# Altium project nrf52840_qiaa_config6.PrjPCB
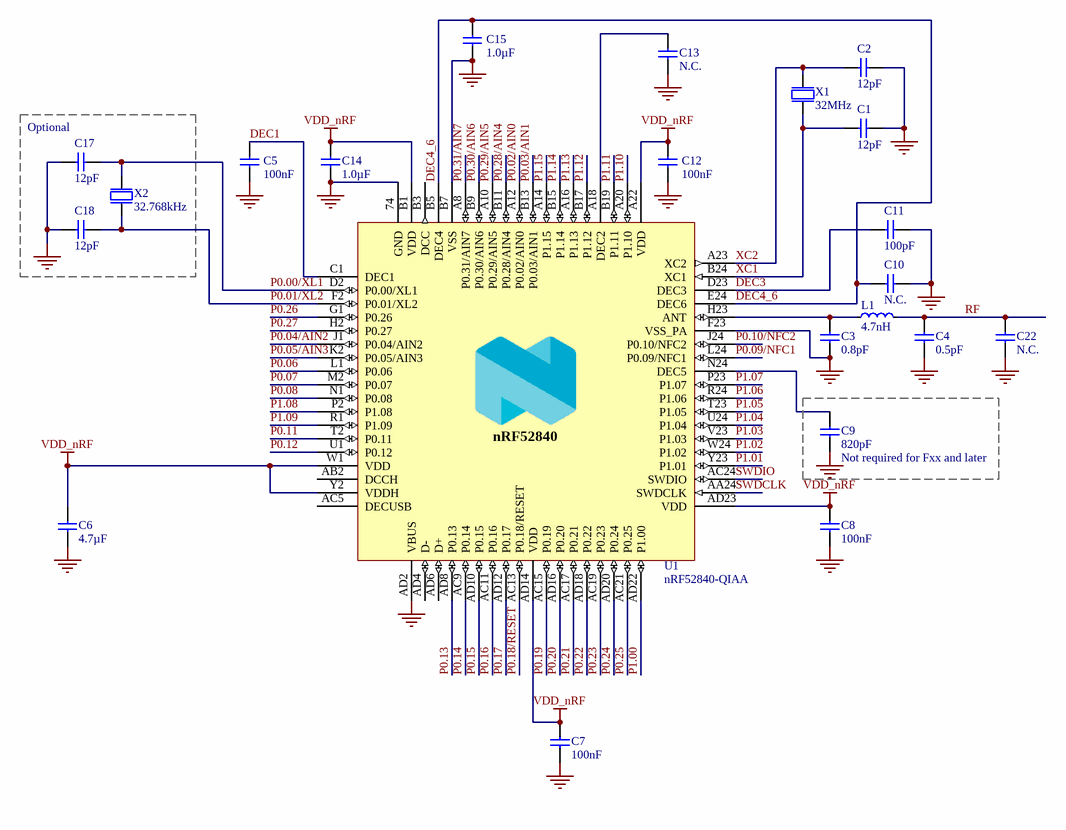
[diagram p0: nrf52840_qiaa_config6.SchDoc]
1 sheet, 22 parts. Net scope: global (net labels, ports and power ports of the same name join across sheets).
Board file: nrf52840_qiaa_config6.PcbDoc

## Sheet nrf52840_qiaa_config6.SchDoc
size A4; Revision: 1.3; SheetNumber: 1; SheetTotal: 1; DrawnBy: RUBR; DocumentSize: A4; RefLayoutTitle: Reference Layout Config. 6: VDD supply, LDO only, No USB; Device: nRF52840-QIAA

### Parts
C1  12pF  [CAPC1005X04L]
C2  12pF  [CAPC1005X04L]
C3  0.8pF  [CAPC1005X04L]
C4  0.5pF  [CAPC1005X04L]
C5  100nF  [CAPC1005X04L]
C6  4.7µF  [CAPC1608X06L]
C7  100nF  [CAPC1005X04L]
C8  100nF  [CAPC1005X04L]
C9  820pF  Assembly: Not required for Fxx and later  [CAPC1005X04L]
C10  N.C.  [CAPC1005X04L]
C11  100pF  [CAPC1005X04L]
C12  100nF  [CAPC1005X04L]
C13  N.C.  [CAPC1005X04L]
C14  1.0µF  [CAPC1608X06L]
C15  1.0µF  [CAPC1608X06L]
C17  12pF  [CAPC1005X04L]
C18  12pF  [CAPC1005X04L]
C22  N.C.  [CAPC1005X04L]
L1  4.7nH  [INDC1005X04L]
U1  nRF52840-QIAA  [AQFN50P700X700X85_HS-74N]
X1  32MHz  [BT-XTAL_2016]
X2  32.768kHz  [XTAL_3215]

### Blocks framed on the sheet
Optional: C17 C18 X2

### Nets
GND: C1.2 C2.2 C3.1 C4.1 C5.2 C6.2 C7.2 C8.2 C9.2 C10.1 C11.2 C12.2 C13.2 C14.2 C15.1 C17.2 C18.2 C22.2 U1.74(GND) U1.AD2(VBUS) U1.B7(VSS) U1.F23(VSS_PA) X1.2(GND) X1.4(GND)
VDD_nRF: C6.1 C7.1 C8.1 C12.1 C14.1 U1.A22(VDD) U1.AD14(VDD) U1.AD23(VDD) U1.B1(VDD) U1.W1(VDD) U1.Y2(VDDH)
DEC1: C5.1 U1.C1(DEC1)
DEC3: C11.1 U1.D23(DEC3)
DEC4_6: C10.2 C15.2 U1.B5(DEC4) U1.E24(DEC6)
P0.00/XL1: C17.1 U1.D2(P0.00/XL1) X2.1(inp)
P0.01/XL2: C18.1 U1.F2(P0.01/XL2) X2.2(out)
P0.02/AIN0: U1.A12(P0.02/AIN0)
P0.03/AIN1: U1.B13(P0.03/AIN1)
P0.04/AIN2: U1.J1(P0.04/AIN2)
P0.05/AIN3: U1.K2(P0.05/AIN3)
P0.06: U1.L1(P0.06)
P0.07: U1.M2(P0.07)
P0.08: U1.N1(P0.08)
P0.09/NFC1: U1.L24(P0.09/NFC1)
P0.10/NFC2: U1.J24(P0.10/NFC2)
P0.11: U1.T2(P0.11)
P0.12: U1.U1(P0.12)
P0.13: U1.AD8(P0.13)
P0.14: U1.AC9(P0.14)
P0.15: U1.AD10(P0.15)
P0.16: U1.AC11(P0.16)
P0.17: U1.AD12(P0.17)
P0.18/RESET: U1.AC13(P0.18/RESET)
P0.19: U1.AC15(P0.19)
P0.20: U1.AD16(P0.20)
P0.21: U1.AC17(P0.21)
P0.22: U1.AD18(P0.22)
P0.23: U1.AC19(P0.23)
P0.24: U1.AD20(P0.24)
P0.25: U1.AC21(P0.25)
P0.26: U1.G1(P0.26)
P0.27: U1.H2(P0.27)
P0.28/AIN4: U1.B11(P0.28/AIN4)
P0.29/AIN5: U1.A10(P0.29/AIN5)
P0.30/AIN6: U1.B9(P0.30/AIN6)
P0.31/AIN7: U1.A8(P0.31/AIN7)
P1.00: U1.AD22(P1.00)
P1.01: U1.Y23(P1.01)
P1.02: U1.W24(P1.02)
P1.03: U1.V23(P1.03)
P1.04: U1.U24(P1.04)
P1.05: U1.T23(P1.05)
P1.06: U1.R24(P1.06)
P1.07: U1.P23(P1.07)
P1.08: U1.P2(P1.08)
P1.09: U1.R1(P1.09)
P1.10: U1.A20(P1.10)
P1.11: U1.B19(P1.11)
P1.12: U1.B17(P1.12)
P1.13: U1.A16(P1.13)
P1.14: U1.B15(P1.14)
P1.15: U1.A14(P1.15)
RF: C4.2 C22.1 L1.2
SWDCLK: U1.AA24(SWDCLK)
SWDIO: U1.AC24(SWDIO)
XC1: C1.1 U1.B24(XC1) X1.1(inp)
XC2: C2.1 U1.A23(XC2) X1.3(out)
NetC3_2: C3.2 L1.1 U1.H23(ANT)
NetC9_1: C9.1 U1.N24(DEC5)
NetC13_1: C13.1 U1.A18(DEC2)

Not connected (* = marked no-connect by the designer): U1 AB2(DCCH) AC5(DECUSB) AD4(D-) AD6(D+) B3(DCC)

### Notes on the sheet
- Title
- Size
- Date:
- A4
- Device
- Sheet         of
- Revision
- File:
- Drawn By:
- (in symbol nRF52840-QIAA) nRF52840

### Library data of the parts
C1 C2 C17 C18 = C0402-12p: Capacitor, NP0, ±2%; Pad Count: 2; Part Number: C0402-12p; LatestRevisionDate: 2011-05-11; Published: 2009-05-08; Value: 12pF; Footprint Doc: 0402
C3 = C0402-0.8p: Capacitor, NP0, ±10%; Pad Count: 2; Part Number: C0402-0.8p; LatestRevisionDate: 2012-11-21; Published: 2009-05-08; Value: 0.8pF; Footprint Doc: 0402
C4 = C0402-0.5p: Capacitor, NP0, ±10%; Pad Count: 2; Part Number: C0402-0.5p; LatestRevisionDate: 2017-02-23; Published: 2009-05-08; Value: 0.5pF; Footprint Doc: 0402
C5 C7 C8 C12 = C0402-100n: Capacitor, X7R, ±10%; Pad Count: 2; Part Number: C0402-100n; LatestRevisionDate: 2009-11-23; Published: 2009-05-08; Value: 100nF; Footprint Doc: 0402
C6 = C0603-4µ7-6.3V-X7R: Capacitor, X7R, ±10%; Pad Count: 2; Part Number: C0603-4µ7-6.3V-X7R; LatestRevisionDate: 2015-06-10; Published: 2015-06-10; Value: 4.7µF; Footprint Doc: 0603
C9 = C0402-820p: Capacitor, NP0, ±5%; Pad Count: 2; Part Number: C0402-820p; LatestRevisionDate: 2009-05-08; Published: 2009-05-08; Value: 820pF; Footprint Doc: 0402
C10 C13 C22 = C0402-N.C.: Not mounted; Pad Count: 2; Assembly: Not mounted; Part Number: C0402-N.C.; LatestRevisionDate: 2009-05-08; Published: 2009-05-08; Value: N.C.; Footprint Doc: 0402
C11 = C0402-100p: Capacitor, NP0, ±5%; Pad Count: 2; Part Number: C0402-100p; LatestRevisionDate: 2009-05-08; Published: 2009-05-08; Value: 100pF; Footprint Doc: 0402
C14 C15 = C0603-1µ0: Capacitor, X7R, ±10%; Pad Count: 2; Part Number: C0603-1µ0; LatestRevisionDate: 2013-06-05; Published: 2009-05-08; Value: 1.0µF; Footprint Doc: 0603
L1 = L0402-4n7: High frequency chip inductor ±5%; Pad Count: 2; Part Number: L0402-4n7; LatestRevisionDate: 2012-09-19; Published: 2009-05-08; Value: 4.7nH; Footprint Doc: 0402
U1 = nRF52840-QIAA: Multi-protocol Bluetooth Low Energy, IEEE 802.15.4, ANT and 2.4GHz proprietary system-on-chip; Pad Count: 73; Part Number: nRF52840-QIAA; LatestRevisionDate: 2017-08-21; Published: 2017-08-21; Value: nRF52840-QIAA; Footprint Doc: AQFN-73
X1 = XTAL_SMD2016_32MHz_8pF_General: XTAL SMD 2016, 32MHz, Cl=8pF, Total Tol: ±40ppm; Pad Count: 4; Part Number: XTAL_SMD2016_32MHz_8pF_General; LatestRevisionDate: 2016-08-19; Published: 2016-08-19; Value: 32MHz; Footprint Doc: XTAL_2016
X2 = XTAL_SMD3215_32.768kHz_9pF_General: XTAL SMD 3215, 32.768kHz, Cl=9pF, Total Tol: ±50ppm; Pad Count: 2; Part Number: XTAL_SMD3215_32.768kHz_9pF_General; LatestRevisionDate: 2016-08-19; Published: 2016-08-19; Value: 32.768kHz; Footprint Doc: XTAL_3215